# EasyEDA Pro project ProDoc_PCB2_2024-07-02.epro

# Board PCB2
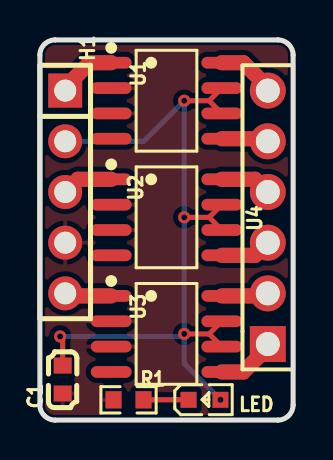
[diagram p0: board, top side]
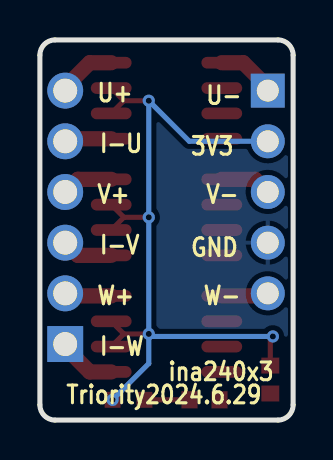
[diagram p1: board, bottom side, seen from below]

Outline 12.7 x 19.05 mm; copper layers: Top Layer, Bottom Layer. Coordinates in mm from the lower left corner of the outline.
Outline path: 0,18.29 0,0.76 arc(0.22,0.22) 0.76,0 11.94,0 arc(12.48,0.22) 12.7,0.76 12.7,18.29 arc(12.48,18.83) 11.94,19.05 0.76,19.05 arc(0.22,18.83) 0,18.29
Stack: Top Layer 0.035mm / Dielectric1 1.51mm FR4 er 4.5 / Bottom Layer 0.035mm

## Design rules (mm)
template: JLCPCB Capability(Two Layers Board)
spacing copperThickness1oz (default): track to track 0.102, other pairs 0.152 to 0.3
spacing copperThickness2oz: track to track 0.203, other pairs 0.152 to 0.3
track width copperThickness1oz (default): min 0.127, default 0.254, max 2.54
track width copperThickness2oz: min 0.203, default 0.254, max 2.54
differential pair differentialPair (default): width min 0.127, default 0.254, max 2.54; gap min 0.152, default 0.152
via viaSize (default): diameter min 0.5, default 0.61, max 10; hole min 0.3, default 0.305, max 6.3

## Placement (name value [footprint] x y rotation side)
C1  100nF  [C0603]  1.14 2.03 90 top
H1  PZ254V-11-05P  [HDR-TH_5P-P2.54-V-M]  1.27 11.43 270 top
LED  KT-0603R  [LED0603-RD]  8.25 1.02 0 top
R1  10kΩ  [R0603]  4.44 1.02 0 top
U1  INA240A2DR  [SOIC-8_L4.9-W3.9-P1.27-LS6.0-BL]  6.35 16 270 top
U2  INA240A2DR  [SOIC-8_L4.9-W3.9-P1.27-LS6.0-BL]  6.35 10.16 270 top
U3  INA240A2DR  [SOIC-8_L4.9-W3.9-P1.27-LS6.0-BL]  6.35 4.32 270 top
U4  PZ254V-11-06-0950  [HDR-TH_6P-P2.54-V-M-1]  11.43 10.16 90 top

## Footprints (pads in the part's own frame, mm; a bottom-side part is the same pattern mirrored in y, then rotated)
C0603
  rect 0.8x0.9 smd: 1(-0.7,0) 2(0.7,0)
HDR-TH_5P-P2.54-V-M
  rect 1.7x1.7 hole 1.1: 1(-5.08,0)
  round 1.7 hole 1.1: 2(-2.54,0) 3(0,0) 4(2.54,0) 5(5.08,0)
HDR-TH_6P-P2.54-V-M-1
  rect 1.8x1.8 hole 1.2: 1(-6.35,0)
  round 1.8 hole 1.2: 2(-3.81,0) 3(-1.27,0) 4(1.27,0) 5(3.81,0) 6(6.35,0)
LED0603-RD
  rect 0.8x0.8 smd: 1(-0.799,0) 2(0.799,0)
R0603
  rect 0.806x0.864 smd: 1(-0.753,0) 2(0.753,0)
SOIC-8_L4.9-W3.9-P1.27-LS6.0-BL
  oval 0.588x2.045 smd: 1(-1.905,-2.772) 2(-0.635,-2.772) 3(0.635,-2.772) 4(1.905,-2.772) 5(1.905,2.772) 6(0.635,2.772) 7(-0.635,2.772) 8(-1.905,2.772)

## Nets
3V3: C1.2 H1.2 LED.2 U1.6 U1.7 U2.6 U2.7 U3.6 U3.7
GND: C1.1 H1.4 R1.1 U1.2 U1.3 U2.2 U2.3 U3.2 U3.3
I_U: U1.5 U4.5
I_V: U2.5 U4.3
I_W: U3.5 U4.1
OUT_U: H1.1 U1.1
OUT_V: H1.3 U2.1
OUT_W: H1.5 U3.1
U: U1.8 U4.6
V: U2.8 U4.4
W: U3.8 U4.2
$1N1155: LED.1 R1.2

Pads without a net: U1 4; U2 4; U3 4

## Via types
v1: diameter 0.61, hole 0.305, Top Layer to Bottom Layer, 5 vias

## Routing (per net, layer and track width the routed paths; a pad name or vN(x,y) marks a point on that pad's centre or on a via; arc(x,y) is an arc through that point)
3V3: length 39.5
  Top Layer w0.254: v1(1.02,4.19) 1.14,4.06 C1.2 ; U2.6 8.49,10.16 ; 8.49,10.16 v1(7.24,10.16) ; 8.49,10.16 U2.7 ; U1.6 8.49,16 ; 8.49,16 U1.7 ; 8.49,16 v1(7.24,16) ; U3.7 8.49,4.32 ; 8.49,4.32 U3.6 ; 8.49,4.32 v1(7.24,4.32)
  Bottom Layer w0.254: H1.2 5.21,13.97 v1(7.24,16) v1(7.24,10.16) v1(7.24,4.32) ; v1(7.24,4.32) 7.24,2.83 v1(9.05,1.02) ; v1(7.24,4.32) 7.11,4.19 v1(1.02,4.19)
I_U: length 2.4
  Top Layer w0.762: U1.5 11.3,14.1 U4.5
I_V: length 2.6
  Top Layer w0.762: U4.3 10.79,8.25 U2.5
I_W: length 3.1
  Top Layer w0.762: U3.5 10.2,2.41 11.6,3.81
OUT_U: length 3.1
  Top Layer w0.762: U1.1 2.5,17.91 1.1,16.51
OUT_V: length 2.6
  Top Layer w0.762: H1.3 1.91,12.06 U2.1
OUT_W: length 2.4
  Top Layer w0.762: U3.1 1.4,6.22 H1.5
U: length 3.1
  Top Layer w0.762: U1.8 10.2,17.91 11.6,16.51
V: length 2.6
  Top Layer w0.762: U2.8 10.79,12.06 U4.4
W: length 2.4
  Top Layer w0.762: U4.2 11.3,6.22 U3.8
$1N1155: length 2.3
  Top Layer w0.254: LED.1 R1.2

## Copper pours and planes (outline as drawn; the poured copper is in the pictures)
GND on Top Layer: -1.52,18.16 -1.52,1.27 0.76,-1.02 12.57,-1.02 14.22,0.63 14.22,18.16 12.19,20.19 0.51,20.19
GND on Bottom Layer: 0.25,20.57 -2.16,18.16 -2.16,1.78 1.02,-1.4 12.45,-1.4 14.35,0.51 14.35,17.6 11.37,20.57

## Text on the board
Bottom Silkscreen Layer: U- | V- | W- | 3V3 | GND | ina240x3 | I-U | I-V | I-W | U+ | V+ | W+ | Triority2024.6.29
